# EAGLE design CO2SensorRev01(CDM7160) (EAGLE 9.1.0)
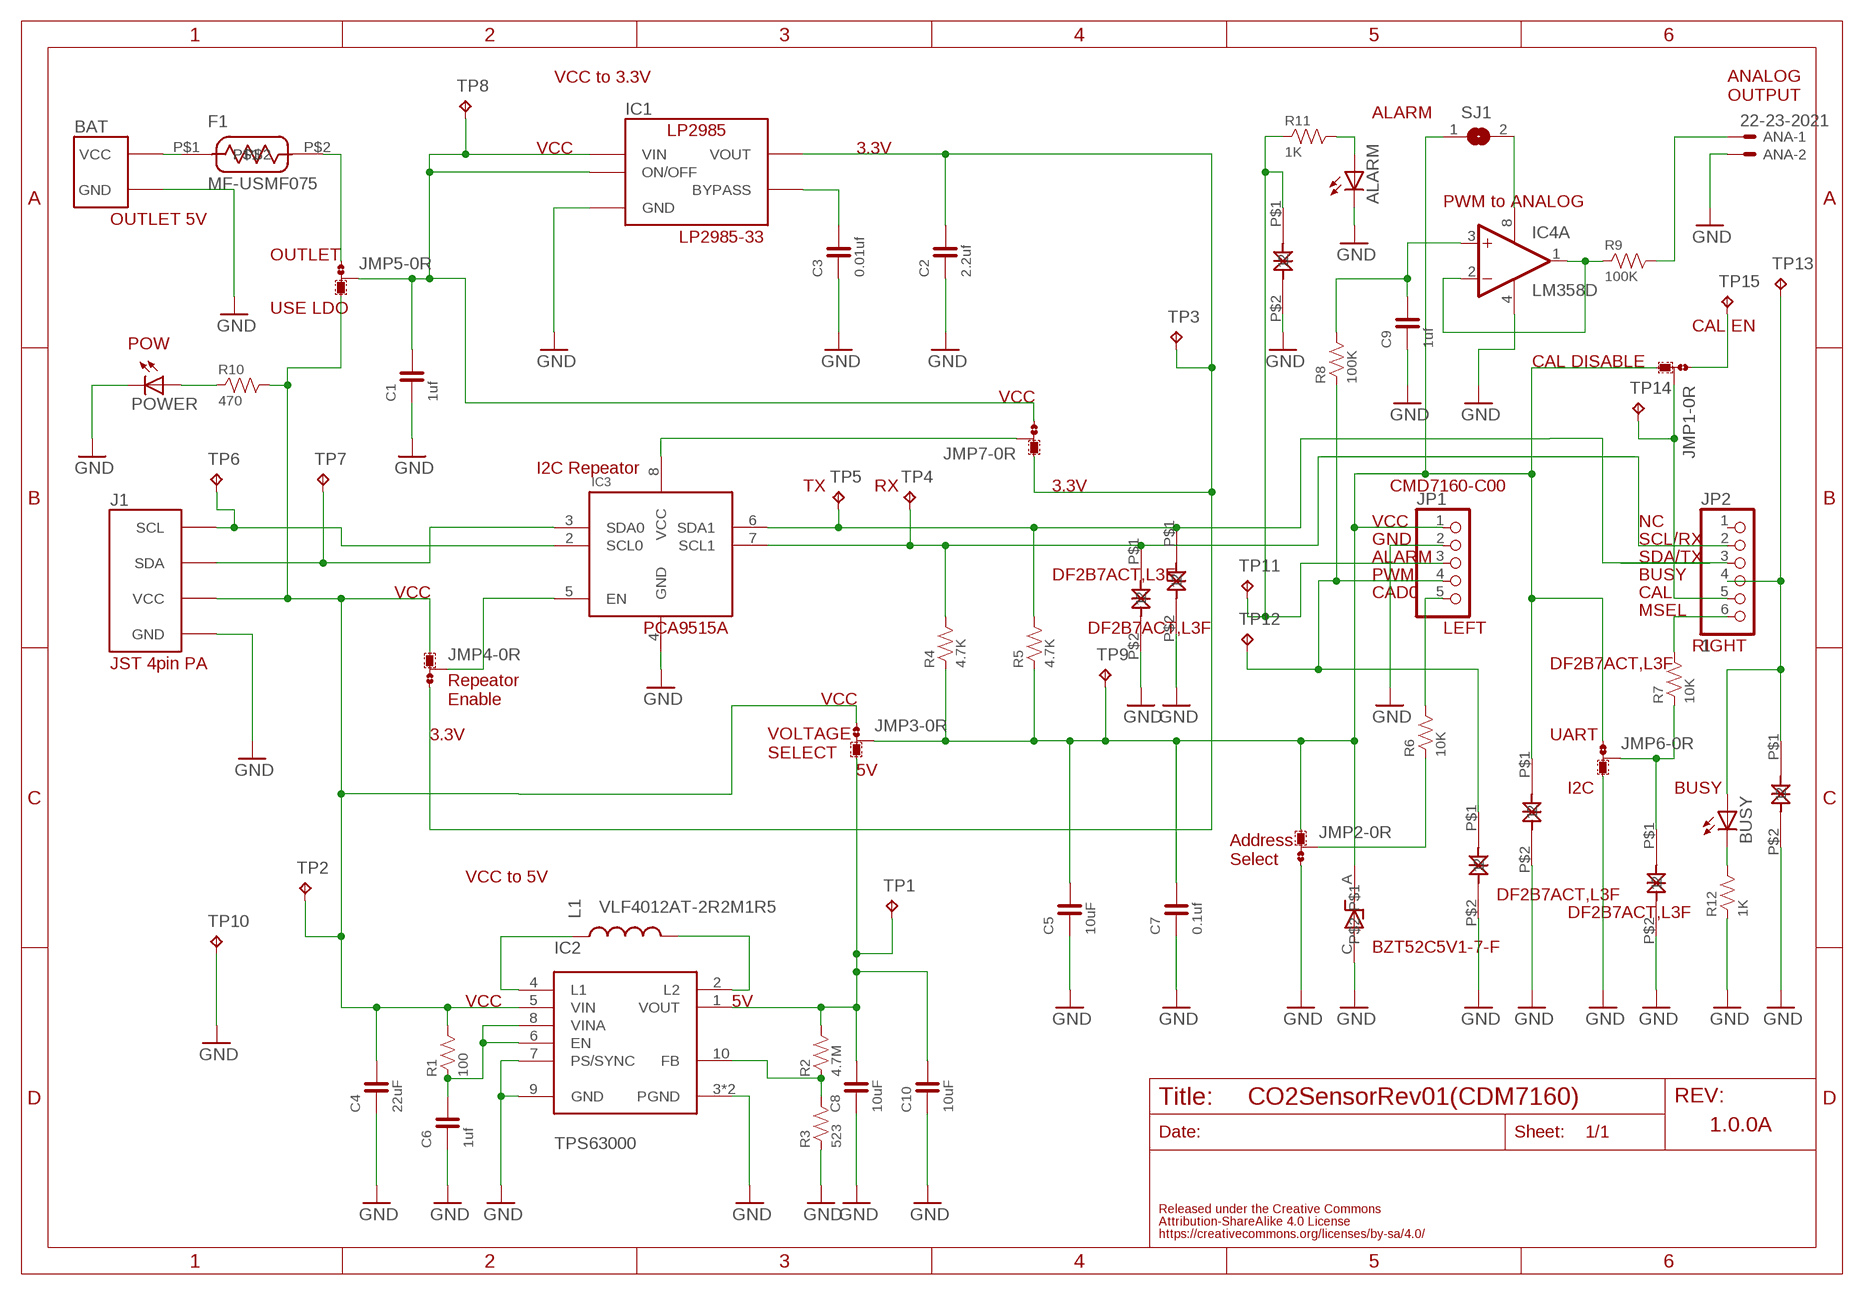
[diagram p0: schematic, sheet 1]

## Parts
ALARM  LEDCHIPLED_0603  [CHIPLED_0603]
ANA  22-23-2021  [22-23-2021]
BAT  FABO_BRICK_2PIN_SIDE  [FABO_BRICK_2PIN_S02B−PASK-2_SILK]
BUSY  LEDCHIPLED_0603  [CHIPLED_0603]
C1  1uf  CAPACITOR-0603  [0603]
C2  2.2uf  CAPACITOR-0603  [0603]
C3  0.01uf  CAPACITOR-0603  [0603]
C4  22uF  CAPACITOR-0805  [0805]
C5  10uF  CAPACITOR-0805  [0805]
C6  1uf  CAPACITOR-0603  [0603]
C7  0.1uf  CAPACITOR-0603  [0603]
C8  10uF  CAPACITOR-0805  [0805]
C9  1uf  CAPACITOR-0603  [0603]
C10  10uF  CAPACITOR-0805  [0805]
D1  BZT52C5V1-7-F  [SOD123]
D3  DF2B7ACT  [DF2B7ACT]
F1  MF-USMF075  [MF-USMF075]
IC1  LP2985-33DBV  [SOT-23-5]
IC2  TPS63000  [DRC-S-PVSON-N10]
IC3  PCA9515  [SO8]
IC4  LM358D  [SO08]
J1  FABO_BRICK_I2C-S04B-PASK-2  [FABO_BRICK_I2C_S04B-PASK-2]
JMP1  0R-JUMPA  [A0R-JMP]
JMP2  0R-JUMPA  [A0R-JMP]
JMP3  0R-JUMPA  [A0R-JMP]
JMP4  0R-JUMPA  [A0R-JMP]
JMP5  0R-JUMPA  [A0R-JMP]
JMP6  0R-JUMPA  [A0R-JMP]
JMP7  0R-JUMPA  [A0R-JMP]
JP1  PINHD-1X5  [1X05]
JP2  1  PINHD-1X6  [1X06]
L1  VLF4012AT-2R2M1R5  [VLF4012A]
POWER  LEDCHIPLED_0603  [CHIPLED_0603]
R1  100  RESISTOR-0603  [0603]
R2  4.7M  RESISTOR-0603  [0603]
R3  523  RESISTOR-0603  [0603]
R4  4.7K  RESISTOR-0603  [0603]
R5  4.7K  RESISTOR-0603  [0603]
R6  10K  RESISTOR-0603  [0603]
R7  10K  RESISTOR-0603  [0603]
R8  100K  RESISTOR-0603  [0603]
R9  100K  RESISTOR-0603  [0603]
R10  470  RESISTOR-0603  [0603]
R11  1K  RESISTOR-0603  [0603]
R12  1K  RESISTOR-0603  [0603]
SJ1  SJW  [SJW]
TP1  TPTP11R  [TP11R]
TP2  TPTP11R  [TP11R]
TP3  TPTP11R  [TP11R]
TP4  TPTP11R  [TP11R]
TP5  TPTP11R  [TP11R]
TP6  TPTP11R  [TP11R]
TP7  TPTP11R  [TP11R]
TP8  TPTP11R  [TP11R]
TP9  TPTP11R  [TP11R]
TP10  TPTP11R  [TP11R]
TP11  TPTP11R  [TP11R]
TP12  TPTP11R  [TP11R]
TP13  TPTP11R  [TP11R]
TP14  TPTP11R  [TP11R]
TP15  TPTP11R  [TP11R]
U$1  DF2B7ACT  [DF2B7ACT]
U$3  DF2B7ACT  [DF2B7ACT]
U$7  DF2B7ACT  [DF2B7ACT]
U$8  DF2B7ACT  [DF2B7ACT]
U$9  DF2B7ACT  [DF2B7ACT]
U$11  DF2B7ACT  [DF2B7ACT]

## Nets
GND: ALARM.C ANA.2 BAT.GND C1.1 C2.1 C3.1 C4.1 C5.1 C6.1 C7.1 C8.1 C9.1 C10.1 D1.C D3.P$2 IC1.2(GND) IC2.3(PGND) IC2.7(PS/SYNC) IC2.9(GND) IC2.TH(PGND) IC3.4(GND) IC4.4(P:V-) J1.GND JMP2.3 JMP6.3 JP1.2 POWER.C R3.1 R12.1 TP10.TP U$1.P$2 U$3.P$2 U$7.P$2 U$8.P$2 U$9.P$2 U$11.P$2
N$1: IC3.2(SCL0) J1.SCL TP6.TP
N$2: IC3.3(SDA0) J1.SDA TP7.TP
N$3: D3.P$1 IC3.7(SCL1) JP2.2 R4.2 TP4.TP
N$4: IC3.6(SDA1) JP2.3 R5.2 TP5.TP U$3.P$1
N$5: C1.2 IC1.1(VIN) IC1.3(ON/OFF) JMP5.2 JMP7.3 TP8.TP
N$6: F1.P$2 JMP5.1
N$7: JMP2.2 R6.1
N$8: IC3.5(EN) JMP4.2
N$9: C2.2 IC1.5(VOUT) JMP4.3 JMP7.1 TP3.TP
N$10: C3.2 IC1.4(BYPASS)
N$11: C6.2 IC2.6(EN) IC2.8(VINA) R1.1
N$12: BAT.VCC F1.P$1
N$13: IC2.10(FB) R2.1 R3.2
N$14: C4.2 IC2.5(VIN) J1.VCC JMP3.1 JMP4.1 JMP5.3 R1.2 R10.2 TP2.TP
N$15: IC2.4(L1) L1.P$1
N$16: IC2.2(L2) L1.P$2
N$17: C8.2 C10.2 IC2.1(VOUT) JMP3.3 R2.2 TP1.TP
N$18: JMP6.2 R7.1 U$7.P$1
N$19: JP2.6 R7.2
N$20: JP1.5 R6.2
N$21: BUSY.A JP2.4 TP13.TP U$8.P$1
N$22: JMP1.2 JP2.5 TP14.TP
N$23: JP1.4 R8.1 TP12.TP U$11.P$1
N$24: JP1.3 R11.1 TP11.TP U$1.P$1
N$25: C9.2 IC4.3(A:+IN) R8.2
N$26: JMP1.1 TP15.TP
N$27: POWER.A R10.1
N$28: ANA.1 R9.2
N$29: IC4.1(A:OUT) IC4.2(A:-IN) R9.1
N$30: ALARM.A R11.2
N$31: BUSY.C R12.2
N$32: IC3.8(VCC) JMP7.2
N$33: C5.2 C7.2 D1.A JMP1.3 JMP2.1 JMP3.2 JMP6.1 JP1.1 R4.1 R5.1 SJ1.1 TP9.TP U$9.P$1
N$34: IC4.8(P:V+) SJ1.2
Unconnected: IC4.5(B:+IN) IC4.6(B:-IN) IC4.7(B:OUT) JP2.1

## Notes on the sheet
- VCC to 3.3V
- ANALOG
  OUTPUT
- ALARM
- VCC | 3.3V
- PWM to ANALOG
- OUTLET 5V
- LP2985-33
- OUTLET
- USE LDO
- CAL EN
- POW
- CAL DISABLE
- VCC
- I2C Repeator
- TX | RX | 3.3V | CMD7160-C00
- VCC | NC
- GND | SCL/RX
- ALARM | SDA/TX
- DF2B7ACT,L3F | PWM | BUSY
- VCC | CAD0 | CAL
- MSEL
- PCA9515A | DF2B7ACT,L3F | LEFT
- RIGHT
- JST 4pin PA | DF2B7ACT,L3F
- Repeator
  Enable
- VCC
- 3.3V | UART
- VOLTAGE
  SELECT
- 5V
- I2C | BUSY
- Address
  Select
- VCC to 5V
- DF2B7ACT,L3F
- DF2B7ACT,L3F
- BZT52C5V1-7-F
- VCC | 5V
- 1.0.0A

## Library data of the parts
ALARM BUSY POWER = led:LED: LED OSRAM: - CHIPLED LG R971, LG N971, LY N971, LG Q971, LY Q971, LO R971, LY R971 LH N974, LH R974 LS Q976, LO Q976, LY Q976 LO Q996 - Hyper CHIPLED LW Q18S LB Q993, LB Q99A, LB R99A - SideLED LS A670, LO A670, LY A670, LG A670, LP A670 LB A673, LV A673, LT A673, LW A673 LH A674 LY A675 LS A676, LA A676, LO A676, LY A676, LW A676 LS A679, LY A679, LG A679 - Hyper Micro SIDELED® LS Y876, LA Y876, LO Y876, LY Y876 LT Y87S - SmartLED LW L88C, LW L88S LB L89C, LB L89S, LG L890 LS L89K, LO L89K, LY L89K LS L896, LA L896, LO L896, LY L896 - TOPLED LS T670, LO T670, LY T670, LG T670, LP T670 LSG T670, LSP T670, LSY T670, LOP T670, LYG T670 LG T671, LOG T671, LSG T671 LB T673, LV T673, LT T673, LW T673 LH T674 LS T676, LA T676, LO T676, LY T676, LB T676, LH T676, LSB T676, LW T676 LB T67C, LV T67C, LT T67C, LS T67K, LO T67K, LY T67K, LW E67C LS E67B, LA E67B, LO E67B, LY E67B, LB E67C, LV E67C, LT E67C LW T67C LS T679, LY T679, LG T679 LS T770, LO T770, LY T770, LG T770, LP T770 LB T773, LV T773, LT T773, LW T773 LH T774 LS E675, LA E675, LY E675, LS T675 LS T776, LA T776, LO T776, LY T776, LB T776 LHGB T686 LT T68C, LB T68C - Hyper Mini TOPLED® LB M676 - Mini TOPLED Santana® LG M470 LS M47K, LO M47K, LY M47K Source: http://www.osram.convergy.de LUXEON: - LUMILED® LXK2-PW12-R00, LXK2-PW12-S00, LXK2-PW14-U00, LXK2-PW14-V00 LXK2-PM12-R00, LXK2-PM12-S00, LXK2-PM14-U00 LXK2-PE12-Q00, LXK2-PE12-R00, LXK2-PE12-S00, LXK2-PE14-T00, LXK2-PE14-U00 LXK2-PB12-K00, LXK2-PB12-L00, LXK2-PB12-M00, LXK2-PB14-N00, LXK2-PB14-P00, LXK2-PB14-Q00 LXK2-PR12-L00, LXK2-PR12-M00, LXK2-PR14-Q00, LXK2-PR14-R00 LXK2-PD12-Q00, LXK2-PD12-R00, LXK2-PD12-S00 LXK2-PH12-R00, LXK2-PH12-S00 LXK2-PL12-P00, LXK2-PL12-Q00, LXK2-PL12-R00 Source: www.luxeon.com KINGBRIGHT: KA-3528ASYC Source: www.kingbright.com
ANA = con-molex:22-23-2021: .100" (2.54mm) Center Header - 2 Pin; MF: MOLEX; MPN: 22-23-2021; OC_FARNELL: 1462926; OC_NEWARK: 25C3832
BAT = FaBo-Template:FABO_BRICK_2PIN
C1-C10 = FaBo-Capacitor:CAPACITOR: CAPACITOR
D1 = FaBo:BZT52C5V1-7-F
D3 U$1 U$3 U$7-U$9 U$11 = FaBo:DF2B7ACT
F1 = FaBo_PTC_ResettableFuses:MF-USMF075
IC1 = FaBo-Supply:LP2985: LP2985
IC2 = FaBo:TPS63000
IC3 = FaBo-Repeater:PCA9515
IC4 = linear:LM358: OP AMP also LM158; LM258; LM2904 Source: http://cache.national.com/ds/LM/LM158.pdf
J1 = FaBo-Template 2:FABO_BRICK_I2C: FaBo Brick I2C
JMP1-JMP7 = jump-0r-smd:0R-JUMP: SMD 0R 0805 Jumper
JP1 = pinhead:PINHD-1X5: PIN HEADER
JP2 = pinhead:PINHD-1X6: PIN HEADER; SPICEPREFIX: X
L1 = FaBo:VLF4012AT-2R2M1R5
R1-R12 = FaBo-Resistors:RESISTOR: RESISTOR
SJ1 = jumper:SJ: SMD solder JUMPER
TP1-TP15 = testpad:TP: Test pad

## Board
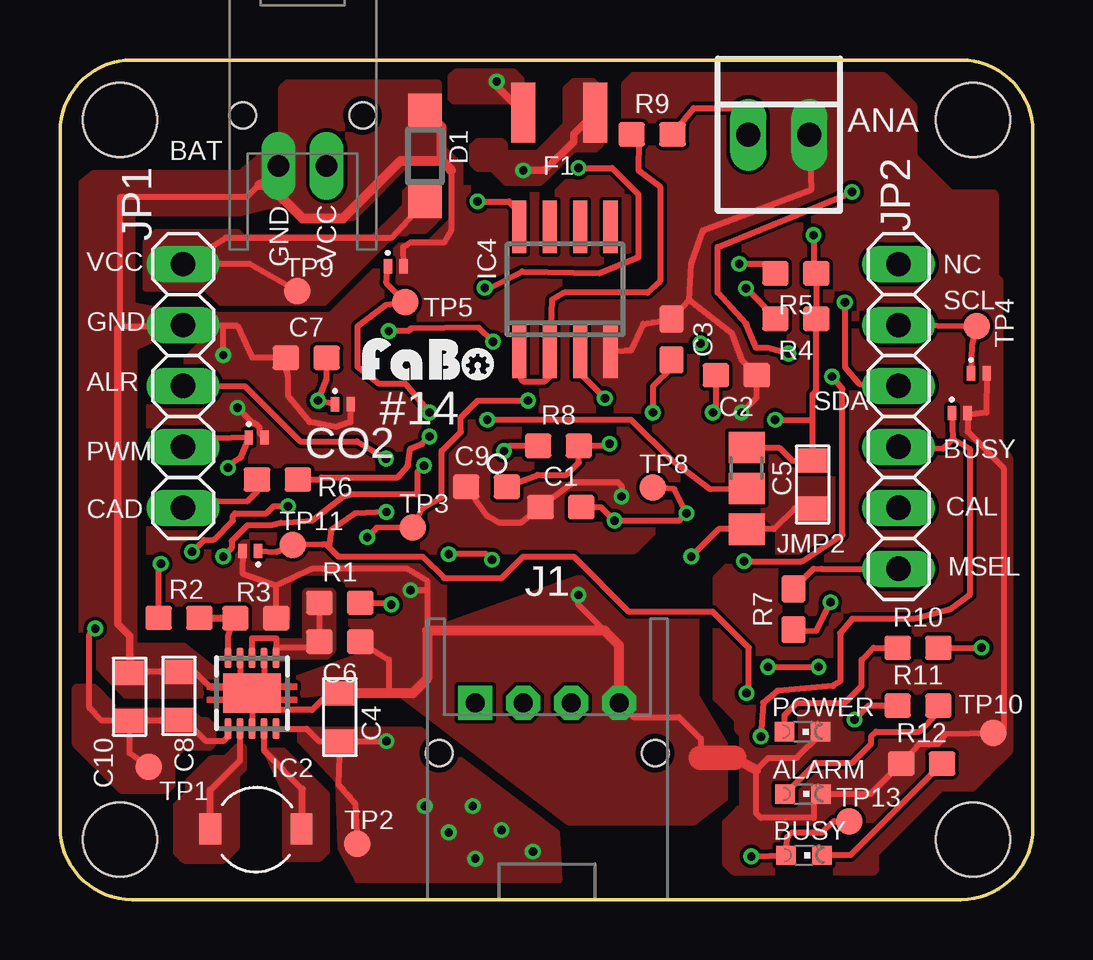
[diagram p1: board, top side]
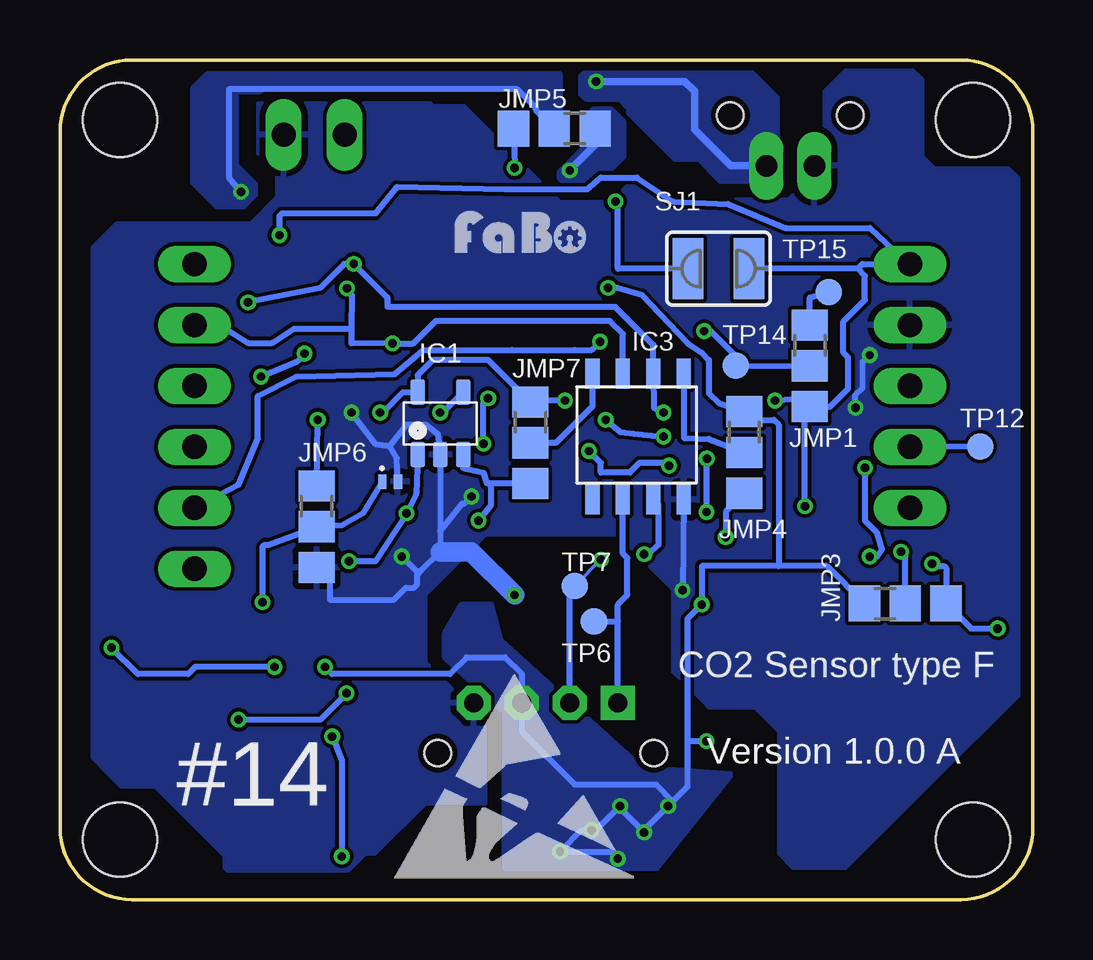
[diagram p2: board, bottom side, seen from below]

Size 40.54 x 35 mm. Coordinates in mm from the lower left corner, seen from the top.
Copper layers (1*16): Top 0.035mm / dielectric 1.5mm / Bottom 0.035mm
Design rules "SeeedStudio_2layer_DRU_no_angle_20140221": minimum track width 6mil, minimum drill 12mil, track to track 6mil, track to pad 6mil, pad to pad 6mil, via to via 6mil, smd to smd 0mil, copper to edge 10mil, drill to drill 10mil, minimum pad ring 10mil, minimum via ring 6mil, stop-mask expansion 2mil, vias tented up to drill 100mil, thermal gap 10mil

### Footprints (pad centres in the part's own frame; a part is rotated, then mirrored left to right if it is on the bottom)
CHIPLED_0603 = smd 0.8 x 0.8: A 0,-0.75; C 0,0.75
22-23-2021 = drill 1 long: 1 -1.27,0; 2 1.27,0
FABO_BRICK_2PIN_S02B−PASK-2_SILK = drill 0.9 pad 1.422 long: GND -1,-0.102; VCC 1,-0.102 | hole 1.1: 2.5,1.998; -2.5,1.998
0603 = smd 1.1 x 1: 1 -0.85,0; 2 0.85,0
0805 = smd 1 x 1.2: 1 -1.254,0; 2 0.746,0
SOD123 = smd 1.4 x 1.4: A 1.9,0; C -1.9,0
DF2B7ACT = smd 0.35 x 0.6: P$1 -0.325,0; P$2 0.325,0
MF-USMF075 = smd 1 x 2.5: P$1 -1.5,0; P$2 1.5,0
SOT-23-5 = smd 0.6 x 1.05: 1 -0.95,-1.3; 2 0,-1.3; 3 0.95,-1.3; 4 0.95,1.3; 5 -0.95,1.3
DRC-S-PVSON-N10 = smd 0.28 x 0.85: 1 -1,-1.475; 2 -0.5,-1.475; 3 0,-1.475; 4 0.5,-1.475; 5 1,-1.475; 6 1,1.475; 7 0.5,1.475; 8 0,1.475; 9 -0.5,1.475; 10 -1,1.475 | smd 2.4 x 1.65: TH 0,0
SO8 = smd 0.6 x 1.25: 1 -1.85,-2.7; 2 -0.58,-2.7; 3 0.69,-2.7; 4 1.96,-2.7; 5 1.96,2.55; 6 0.69,2.55; 7 -0.58,2.55; 8 -1.85,2.55
SO08 = smd 0.6 x 2.2: 1 -1.905,-2.6; 2 -0.635,-2.6; 3 0.635,-2.6; 4 1.905,-2.6; 5 1.905,2.6; 6 0.635,2.6; 7 -0.635,2.6; 8 -1.905,2.6
FABO_BRICK_I2C_S04B-PASK-2 = drill 0.8 pad 1.422 octagon: GND -3,0; SDA 1,0; VCC -1,0 | drill 0.8 pad 1.422 square: SCL 3,0 | hole 1.1: 4.5,2.1; -4.5,2.1
A0R-JMP = smd 1.5 x 1.3: 1 0,1.7; 2 0,0; 3 0,-1.7
1X05 = drill 1.016 long: 1 -5.08,0; 2 -2.54,0; 3 0,0; 4 2.54,0; 5 5.08,0
1X06 = drill 1.016 long: 1 -6.35,0; 2 -3.81,0; 3 -1.27,0; 4 1.27,0; 5 3.81,0; 6 6.35,0
VLF4012A = smd 0.9 x 1.3: P$1 1.9,0; P$2 -1.9,0
SJW = smd 1.27 x 2.54: 1 -1.27,0; 2 1.27,0
TP11R = smd 1.1 x 1.1: TP 0,0
FABO-SHINOBI = hole 3.1: 2.5,32.5; 38.04,32.5; 38.04,2.5; 2.5,2.5

### Placement (x,y rotation side)
ALARM  30.96,4.4 270 top
ANA  29.95,31.88 0 top
BAT  10.11,30.69 0 top
BUSY  31,1.85 270 top
C1  20.87,16.36 0 top
C2  28.18,21.86 180 top
C3  25.48,23.35 270 top
C4  11.66,7.35 270 top
C5  31.36,17.56 90 top
C6  11.66,10.75 180 top
C7  10.26,22.58 0 top
C8  4.96,8.24 270 top
C9  17.77,17.21 0 top
C10  2.9,8.2 270 top
D1  15.2,31 270 top
D3  38.29,21.94 0 top
F1  20.8,32.8 0 top
IC1  24.69,19.85 0 bottom
IC2  8,8.6 0 top
IC3  16.51,19.37 0 bottom
IC4  21.04,25.44 0 top
J1  20.3,8.2 180 top
JMP1  9.3,22.25 0 bottom
JMP2  28.61,17.14 0 top
JMP3  5.32,12.34 90 bottom
JMP4  12.03,18.64 0 bottom
JMP5  19.94,32.14 270 bottom
JMP6  29.85,15.54 0 bottom
JMP7  20.94,19.04 0 bottom
JP1  5.13,21.41 270 top
JP2  34.94,20.14 270 top
L1  8.16,2.95 0 top
POWER  30.94,7 270 top
R1  11.66,12.37 0 top
R2  4.96,11.74 180 top
R3  8.16,11.73 180 top
R4  30.66,24.21 180 top
R5  30.66,26.1 180 top
R6  9.06,17.51 180 top
R7  30.56,12.1 90 top
R8  20.77,18.92 0 top
R9  24.67,31.9 0 top
R10  35.75,10.49 0 top
R11  35.75,8.08 0 top
R12  35.9,5.67 0 top
SJ1  13.1,26.3 180 bottom
TP1  3.69,5.54 0 top
TP2  12.39,2.33 0 top
TP3  14.69,15.52 0 top
TP4  38.19,23.91 0 top
TP5  14.39,24.9 0 top
TP6  18.29,11.59 0 bottom
TP7  19.09,13.08 0 bottom
TP8  24.69,17.17 0 top
TP9  9.89,25.36 0 top
TP10  38.89,6.95 0 top
TP11  9.69,14.79 0 top
TP12  2.19,18.88 0 bottom
TP13  32.89,3.27 0 top
TP14  12.39,22.26 0 bottom
TP15  8.5,25.33 0 bottom
U$1  7.93,14.53 180 top
U$2  [FABO-SHINOBI]  0,0 0 top
U$3  13.99,26.4 0 top
U$5  [ESD_10.00]  26.7,0.8 0 bottom
U$6  [LOGO_FABO_S]  15.4,21.5 0 top
U$7  26.79,17.42 0 bottom
U$8  37.49,20.28 0 top
U$9  11.79,20.64 0 top
U$10  [LOGO_FABO_S]  21.3,26.8 0 bottom
U$11  8.19,19.26 0 top

### Tracks (layer width: path | path; a pad name or v marks a point on that pad's centre or on a via)
GND  (via drill 0.35)
  Top 0.254: IC2.TH IC2.3 | IC2.9 7.5,9.4 7.6,9.3 7.6,9 7.75,8.85 | IC2.7 8.5,9.1 8.15,8.75 | 8.15,8.75 IC2.TH | 7.75,8.85 IC2.TH | C4.1 11.2,8.6 10.5,7.9 9,7.9 8.15,8.75 | 7.75,8.85 6.25,8.85 5.61,9.49 C8.1 2.94,9.49 C10.1 | C5.1 30.61,16.31 29.74,15.44 JMP2.3 27.44,15.44 v26.3,14.3 | POWER.C 31.69,6.89 30.7,5.9 29.5,5.9 29,5.4 29,3.6 29.2,3.4 31.4,3.4 31.41,3.41 31.41,4.1 ALARM.C 33.78,4.4 R12.1 35.8,6.5 36.6,6.5 36.9,6.9 TP10.TP 39.32,7.1 39.32,18 37.81,19.5 37.81,20.2 | C6.1 13.7,10 13.7,8.6 | IC4.4 23.8,22.9 24.3,24 C3.1 26.22,24.98 | ANA.2 31.3,29.6 26.8,27.9 26.3,26.5 26.22,24.98 | 26.22,24.98 28,23.6 28.43,22.46 C2.1 29,20.9 v28.4,20.3 | R3.1 9,13.1 | 9,13.1 10.54,13.8 14.47,13.8 15.3,13.3 15.3,12.9 | 15.3,12.9 15.3,11.2 | v14.6,12.9 15.3,12.9 | U$1.P$2 7.6,13.6 9,13.1 | C7.1 9.3,22.58 | 9.3,22.58 8,22.6 7.4,23.9 6.8,23.91 | 6.8,23.91 JP1.2 5.08,23.9 2.5,23.9 2.5,29.3 7.8,29.3 8.3,29.8 BAT.GND | U$3.P$2 14.3,27.2 14.6,27.4 16,27.4 16.3,27.9 16.3,30.4 | U$9.P$2 12.1,19.9 11.5,19.7 10.4,19.9 9.5,21 9.5,21.8 9.3,22.58 | U$11.P$2 8.32,19.46 8.32,19.68 8.16,19.84 8.06,19.84 v7.4,20.5 | v6.8,22.7 6.8,23.91 | U$8.P$2 37.81,20.2 | C9.1 17.8,16 18.3,15.7 19.2,15.7 C1.1 21.26,17.29 21.27,17.29 21.28,17.3 21.4,17.4 23.24,17.4 23.4,17.24 v23.4,16.8 | D3.P$2 38.6,20.3 37.81,20.2 | 13.7,8.6 | J1.GND 23.9,7.6 25.8,7.6 26.7,6.7 26.7,5.9 | 23.3,10.6 21.6,12.3 v21.6,12.7
  Top 0.305: C10.1 2.9,11 2.4,11.5 2.4,23.8 2.5,23.9
  Top 0.406: 28.1,5.9 29,5.4 | 8.3,29.8 8.71,29.8 10.1,28.4 11.8,28.4 14.2,30.8 15.9,30.8 | 15.9,30.8 16.3,30.4 | 15.9,30.8 15.9,32.2 D1.C | J1.GND 23.3,10.6 22.7,11.2 15.3,11.2 15.3,9.2 14.7,8.6 13.7,8.6 C4.1
  Top 1.016: 26.7,5.9 28.1,5.9
  Bottom 0.254: 24.7,15.36 IC1.2 24.8,19.4 25.3,19.8 26.1,19.8 26.8,18.9 | 25.5,13.7 25.66,13.54 25.66,13.14 25.8,13 26.13,13 26.63,12.5 29.3,12.5 29.3,13.29 JMP6.3 | 25.5,13.7 24.7,14.5 24.7,15.36 | IC3.4 v14.6,12.9 | v28.4,20.3 27.4,19 26.8,18.9 | U$7.P$2 26.5,18.4 26.8,18.9 | v7.4,20.5 7.4,21.02 7.09,21.33 7.09,22.41 v6.8,22.7 | 24.7,15.36 23.8,16.5 23.7,16.5 v23.4,16.8 | v26.3,14.3 25.7,13.7 25.5,13.7
  Bottom 0.813: v21.6,12.7 23.4,14.5 24.7,14.5
  pour Top (no thermals): 6.79,8.14 21.55,13.4 26.5,13.4 26.5,8.5 27.7,6.5 27.7,4.2 26.4,3.2 21.21,3.2 13.71,8.91
  pour Top (no thermals): 6.9,9.2 6.9,8.5 2.71,8.5 0.9,10.36 0.9,29.9 1.4,30.3 7.5,30.3 8.6,31.2 9.6,30.4 9.1,29 7.5,28.6 3,28.6 3,24.8 4.7,24.5 4.7,23.7 3.1,23 3.1,10.6 5.15,10.6
  pour Top (no thermals): 6.1,24.3 11.3,24.3 14.2,27.2 15.3,27.2 16.4,28.3 16.4,30.3 15.8,30.9 14.6,30.9 12.2,28.5 10.2,28.5 9.7,29 9.7,29.3 10,29.6 10,31.1 9.3,31.8 9.3,33.8 9.5,34 15.7,34 15.7,31.5 16.6,30.6 16.6,29.6 17.3,29.6 17.4,29.5 18.1,29.5 18.3,29.3 20.6,29.3 21.8,30.5 22.3,30.5 23.6,31.8 23.6,34 23.9,34.3 24.1,34.3 34.3,34.3 35.5,33.1 35.5,31 37,29.5 37.1,29.4 38.9,29.4 38.9,26 39.1,25.8 39.1,18.8 39.5,18.4 39.5,6.2 38.6,5.3 38,4.7 36.7,4.7 33.9,1.9 33.9,1.2 28.1,1.2 27.8,1.5 27.8,3.2 27.9,3.3 28.3,3.7 28.5,3.7 28.5,6.9 28.3,7.1 28.3,7.5 27.4,8.4 27.4,13.4 28.4,14.4 29.8,14.4 30,14.6 30,15.5 29.2,16.3 25.6,16.3 23.9,14.6 16.2,14.6 16,14.4 15.9,14.3 15.9,11.5 15.8,11.4 13.3,10.7 13,10.7 12.1,11.6 12.1,13.2 11.6,13.7 9.9,13.7 9.4,13.2 9.4,11.7 9.1,11.4 4.3,11.4 3.8,11.9 3.8,21 6,23.2 6,24.2 14,11.4
  pour Bottom: 0.6,30.1 1,30.5 4.1,30.5 4.2,30.6 4.6,31 4.6,34.2 5,34.6 5.8,34.6 7.8,34.6 8.2,34.2 8.6,33.8 8.7,33.7 8.7,31.2 8.7,30.7 10.2,29.2 13.7,29.2 13.8,29.3 14.91,30.41 16.29,30.41 17.6,29.1 18,29.1 19.7,29.1 20.8,30.2 23.7,33.1 25,33.1 25.1,33.2 32.3,33.2 32.3,31.1 31.5,30.3 31.5,29.3 32.6,28.2 32.8,28.2 38.2,28.2 39.2,27.2 39.2,5.9 38.5,5.2 38,4.7 36.6,4.7 33.7,1.8 33.7,1.3 33.6,1.2 28.5,1.2 27.8,1.9 27.4,1.9 25.3,4 22.8,4 22.8,7.4 25.3,9.9 25.3,12.7 23.6,14.4 22.8,15.2 21.1,15.2 17.3,15.2 15,12.9 15,9.5 13.7,8.2 13.5,8 11.6,8 10.6,7 10.6,1.9 10,1.3 9,1.3 7.8,1.3 4.2,4.9 0.6,8.5
N$1
  Bottom 0.254: IC3.2 17.09,14.42 16.9,14.23 16.9,12.7 17.3,12.3 17.3,11.6 | J1.SCL 17.3,11.6 | TP6.TP 17.31,11.59 17.3,11.6
N$2  (via drill 0.35)
  Top 0.254: v18,14.17 17.77,14.4 v16.2,14.4
  Bottom 0.152: TP7.TP v18,14.17
  Bottom 0.254: J1.SDA 19.3,12.87 TP7.TP | v16.2,14.4 16,14.4 15.6,14.8 15.6,16.45 IC3.3
N$3  (via drill 0.35)
  Top 0.254: JP2.2 TP4.TP 38,23.1 D3.P$1 | v28.59,25.48 29.81,24.26 R4.2
  Bottom 0.254: JP2.2 33.8,23.9 32.7,23.2 31.7,23.2 30.8,23.8 28.4,23.8 | 28.4,23.8 28.38,25.18 28.59,25.39 v28.59,25.48 | 28.4,23.8 28.4,23.19 v26.68,23.18 25.82,23.18 24.88,24.12 17.62,24.12 17.09,23.59 IC3.7
N$4  (via drill 0.35)
  Top 0.254: v28.3,26.5 29.41,26.5 R5.2 | v32.7,24.9 32.7,23.2 32.7,22.2 33.3,21.5 JP2.3 | U$3.P$1 13.6,25.7 TP5.TP 13.6,24.8 12.4,23.9 12.4,22.2 13.3,21.5 14.4,21.5 v15.4,20.3
  Bottom 0.254: 15.82,23.12 IC3.6 15.8,20.5 v15.4,20.3 | 15.82,23.12 16.9,24.2 17.4,24.7 26.9,24.7 26.9,25.1 v28.3,26.5 28.7,26.5 29.7,25.5 v32.7,24.9 | 15.82,23.12
N$5  (via drill 0.35)
  Top 0.254: C1.2 22.54,16.36 v23.1,15.8 25.8,15.8 v26.1,16.1 25.6,17.11 24.79,17.17 TP8.TP | v33,29.5 27.4,27.2 27.4,25.3 28.6,24 29,23 29.5,23 v30.35,22.76 | v28.5,14.1 30.9,14.1 32.6,15.2 32.6,21.3 v32.17,21.8
  Bottom 0.254: IC1.3 23.74,18 22.9,17.8 22.77,17.41 | IC1.1 25.7,16.9 v26.1,16.1 27.4,14.1 v28.5,14.1 | JMP5.2 20.71,32.91 20.71,33.01 21.49,33.78 33.5,33.78 33.5,30.1 v33,29.5 | v32.17,21.8 30.63,22.46 v30.35,22.76 | 22.77,17.41 22.75,17.35 22.65,17.35 | 22.65,17.35 22.6,17.2 22.6,16.43 v23.1,15.8 | 22.77,17.41 | JMP7.3 22.65,17.35
  pour Bottom (no thermals): 19.7,34.4 34.4,34.4 35,33.8 35,29.9 34.1,29 34,28.9 32.9,28.9 32.4,29.4 32.4,29.8 33.2,30.6 33.2,30.8 33.2,33.7 32.2,33.7 32.1,33.8 21.5,33.8 20.7,33 20.6,33 20.3,32.7 19.8,32.7 19.7,32.8
N$6  (via drill 0.35)
  Top 0.305: F1.P$2 21.4,31.9 21.4,31.6 20.2,30.4 v19.3,30.4
  Bottom 0.305: v19.3,30.4 18.24,31.46 JMP5.1
  pour Bottom (no thermals): 17.6,32.9 18.3,32.9 18.4,32.8 18.5,32.7 18.5,31.5 19.7,30.3 19.7,30.1 19.3,29.7 19.1,29.7 18.4,29.7 17.1,31 17.1,32.4
  pour Top (no thermals): 17.2,30.7 17.2,31.4 17.3,31.5 17.4,31.6 18.4,31.6 18.5,31.5 18.5,31.1 19.9,31.1 21.1,32.3 21.1,32.8 21.1,33.8 21.4,34.1 22.2,34.1 22.5,33.8 22.5,33.6 22.5,31.5 22.3,31.3 21.4,31.3 20,29.9 18.6,29.9 18,30.5 17.4,30.5
N$7  (via drill 0.35)
  Top 0.254: JMP2.2 27.1,17.1 25.5,18.3 23.8,20 v17.8,20 | v15.4,19.3 15.08,18.98 14.6,18.8 14.5,18.07 14.07,17.6 10.9,17.6 10.81,17.51 R6.1
  Bottom 0.254: v17.8,20 17.2,19.5 15.5,19.3 v15.4,19.3
N$8
  Bottom 0.254: IC3.5 14.55,19.25 13.5,19.2 JMP4.2
N$9  (via drill 0.35)
  Top 0.254: C2.2 27.33,20.43 v27.2,20.3 | v19.5,20.8 17.4,20.8 16.7,20.1 16.7,19.5 15.9,18.7 15.9,16.76 15.1,16.3 TP3.TP 13.19,15.49 v12.8,15.1
  Bottom 0.254: JMP7.1 21,20.8 | 21,20.8 22.7,22.5 25,22.5 25.64,21.86 IC1.5 26.25,21.15 27.1,20.3 v27.2,20.3 | JMP4.3 12.8,16.17 v12.8,15.1 | v19.5,20.8 21,20.8
N$10  (via drill 0.35)
  Top 0.254: C3.2 25.48,22.18 24.7,21.4 v24.7,20.3
  Bottom 0.254: v24.7,20.3 24.59,20.3 IC1.4
N$11
  Top 0.254: IC2.8 8,10.9 9,10.9 9,10.5 | 9,10.5 IC2.6 | 9,10.5 10.56,10.5 C6.2 R1.1
  pour Top (no thermals): 9.1,10.1 9.1,10.6 9.2,10.7 10.3,10.7 10.3,12.8 11.3,12.8 11.3,10.4 11.1,10.2 10.2,10.2 9.5,10.2 9.4,10.1 9.2,10.1
N$12  (via drill 0.35)
  Top 0.305: v18.2,34.1 18.2,33.9 F1.P$1
  Bottom 0.305: BAT.VCC 12.59,30.59 14.1,32.1 14.1,33.7 14.5,34.1 16.8,34.1 17,34.1 v18.2,34.1
  pour Bottom (no thermals): 10.7,30 10.7,33.4 11.7,34.4 18.7,34.4 18.8,34.3 18.8,33.6 18.7,33.5 18.6,33.4 17.2,33.4 16.8,33 16.8,32.8 14.9,30.9 13.9,30.9 13,30
  pour Top (no thermals): 16.5,34.5 18.8,34.5 18.9,34.5 19.2,34.2 19.2,33.3 16.4,33.3 16.3,33.4 16.3,34.3
N$13
  Top 0.254: IC2.10 7,11 7.2,11.62
  Top 0.3: 7.2,11.62 R3.2 R2.1
N$14  (via drill 0.35)
  Top 0.254: C4.2 10.8,6.6 10.28,7.12 9.4,7.12 IC2.5 | C4.2 v13.6,6.6 | R1.2 13.73,12.37 v13.8,12.3 | R10.2 v38.39,10.49 v38.4,10.5 | v21.6,30.5 23,30.5 24.1,29.4 24.1,26.77 22.47,26.11 19.26,26.18 17.9,25.5 v17.7,25.5 | C4.2 11.6,4.8 12.3,4 TP2.TP | v29.5,9.7 v31.6,9.7
  Bottom 0.254: v13.6,6.6 14.4,6.6 | 14.4,6.6 14.4,11.7 v13.8,12.3 13.8,13.9 10.6,13.9 | JMP3.1 8.58,13.9 10.6,13.9 | 10.6,13.9 10.6,19.8 10.8,20 11.69,20 JMP4.1 13.1,20.7 13.5,21.1 13.5,22.5 13.8,22.8 14.4,23.2 16.3,25.2 17.3,25.5 v17.7,25.5 | v38.4,10.5 37.3,9.4 35.2,9.4 34.9,9.7 v31.6,9.7 | JMP5.3 v21.6,30.5 | 14.4,6.6 | 14.4,6.6 14.4,4.7 15,4.1 | 15,4.1 v15.2,3.9 16.2,2.9 v16.2,2.8 17.2,3.8 v17.2,3.9 18.2,2.9 v18.4,2.9 18.8,2.9 v19.7,2 17.6,2 v17.3,1.7 | 15,4.1 15.7,4.8 19.1,4.8 21.3,7 J1.VCC 21.3,9.4 22,10.1 23.6,10.1 24.3,9.4 29.2,9.4 v29.5,9.7
  pour Top (no thermals): 10,7.1 15,7.1 20.7,2.8 20.8,0.8 12.4,0.8 11.7,2.1 11.6,4.9 10,6.6
  pour Bottom (no thermals): 12.6,5.24 12.6,5.2 15.7,1.3 22,1.3 22,7.8 24.5,10.1 24.5,11.1 23.8,12.3 22.58,12.3 22.19,10.81 16.33,5.5
N$15
  Top 0.254: 10.1,4.6 8.5,6.2 IC2.4
  Top 0.3: 10.1,4.6 10.1,2.99 L1.P$1
  pour Top (no thermals): 8.6,6.2 9.3,6.2 9.4,6.1 10.6,4.9 11.1,4.4 11.1,2 10.8,1.7 10.6,1.7 9.5,1.7 9.4,1.8 9.4,4.5
N$16
  Top 0.254: 6.26,4.56 7.5,5.8 IC2.2
  Top 0.3: L1.P$2 6.26,4.56
  pour Top (no thermals): 7.3,2.4 7.3,3.9 7.3,5.2 7.6,5.5 7.6,6.3 7.4,6.3 6.9,5.8 6.3,5.8 5.4,4.9 5.4,4.4 4.9,3.9 4.9,3.4 4.9,2 5,1.9 5.2,1.7 6.8,1.7 7.3,2.2
N$17  (via drill 0.35)
  Top 0.254: IC2.1 7,6.8 6.8,6.6 6.1,6.6 5.21,7.49 C8.2 4.92,7.45 C10.2 | C10.2 1.75,7.45 1.22,7.98 1.22,11.05 v1.47,11.3 | TP1.TP 2.9,6.1 C10.2 | R2.2 4.11,13.91 v4.2,14
  Bottom 0.254: v1.47,11.3 2.58,11.3 JMP3.3 3.62,13.82 3.7,13.9 4.1,13.9 v4.2,14
  pour Top (no thermals): 0.7,8.8 1.4,8.8 2.1,8.1 2.1,7.8 5.4,7.8 5.8,7.4 6.1,7.4 6.3,7.2 6.3,6.5 6.2,6.4 5.1,6.4 4.6,5.9 4.6,4.8 4.4,4.6 3.3,4.6 2.6,4.6 0.7,6.5
N$18  (via drill 0.35)
  Top 0.254: R7.1 31.5,11.2 v32.1,12.4
  Bottom 0.254: v32.1,12.4 32.1,14.7 32,14.8 31.88,14.79 JMP6.2 28.8,15.6 27.92,16.1 U$7.P$1
N$19
  Top 0.254: JP2.6 31.72,13.79 31.4,13.8 31.32,13.71 R7.2
N$20
  Top 0.254: R6.2 8.21,17.01 7.8,16.6 5.43,16.63 JP1.5
N$21  (via drill 0.35)
  Top 0.254: TP13.TP 32.24,3.27 31.77,2.79 30.49,2.79 30.3,2.6 BUSY.A v28.8,1.8 | U$8.P$1 37.2,19.2 | 37.2,19.2 37.9,18.8 37.9,12.7 37.1,12.1 35.6,11.7 33,11.7 32.5,11.1 32.5,9.1 32.2,8.9 29.9,8.7 29.3,8.2 v29.2,6.8 | JP2.4 36.8,18.8 37.2,19.2
  Bottom 0.254: v29.2,6.8 28.8,5.8 v28.8,1.8
N$22  (via drill 0.35)
  Top 0.254: v13.7,23.7 14.53,23.7 14.62,23.8 17.46,23.84 v18.04,23.26
  Bottom 0.254: JP2.5 33.1,17.3 32.3,19.2 32.3,21 30.7,21.8 26.6,21.9 25.4,22.9 25.18,22.9 25.17,22.91 21.7,22.91 19.1,22.91 18.39,22.91 v18.04,23.26 | JMP1.2 TP14.TP 12.39,22.66 13.43,23.7 v13.7,23.7
N$23  (via drill 0.35)
  Top 0.254: JP1.4 5.7,19.2 U$11.P$1 7.5,18.4 7,18.1 v7,18 | v15.16,18.09 14.9,17.83 14.9,16.9 12.2,16.9 11.8,16.8 10.5,15.8 9.2,15.7 8.8,15.6 7.8,15.6 7.15,14.95 7.15,14.65 v6.8,14.3 | v18.5,18.7 18.72,18.92 R8.1
  Bottom 0.254: TP12.TP JP1.4 | v6.8,14.3 6.5,14.3 6.3,14.6 6.5,15.3 7,15.8 v7,18 | v15.16,18.09 15.27,18.2 16.4,18.2 16.8,17.8 18,17.8 18,18.2 v18.5,18.7
N$24  (via drill 0.35)
  Top 0.254: R11.1 33.68,8.08 v33.1,7.5 | U$1.P$1 9,14.5 TP11.TP 10.93,14.8 11.1,14.8 11.2,14.7 | JP1.3 7.7,21.4 10,19.1 12.38,19.1 v13.59,18.38 | 11.2,14.7 11.6,14.3 15.1,14.3 16,13.4 18.4,13.4 19.3,14.3 21.4,14.3 23.7,12 27.2,12 28.7,10.5 28.7,8.7 v28.6,8.6 | v13.6,16.16 12.3,16.1 11.3,15.4 11.2,14.7
  Bottom 0.254: v13.6,16.16 v13.59,18.38 | v28.6,8.6 29.7,7.5 v33.1,7.5
N$25  (via drill 0.35)
  Top 0.254: C9.2 19.9,17.7 21.1,17.7 21.62,18.22 R8.2 22.82,18.92 v22.9,19 | IC4.3 21.68,21.93 v22.7,20.9
  Bottom 0.254: v22.9,19 22.9,20.7 v22.7,20.9
N$26
  Bottom 0.254: JMP1.1 9.3,25.1 TP15.TP
N$27
  Top 0.254: POWER.A 30.19,7.69 30.7,8.2 32.7,8.2 33.4,8.9 33.4,10 33.89,10.49 R10.1
N$28
  Top 0.254: R9.2 26.4,33 28,33 28.7,32.5 ANA.1
N$29
  Top 0.254: R9.1 24.11,31.61 24.1,30.4 25,29.73 25,25.79 24.48,25.3 21,25.3 20.5,25 IC4.2 20.41,22.3 20.4,22.3 20.4,21.8 20.2,21.6 19.3,21.6 19.2,21.7 19.2,22.77 IC4.1
N$30
  Top 0.254: ALARM.A 31.51,5.7 33,5.7 33.8,6.5 33.8,6.8 34,7 35.8,7 36.6,7.8 R11.2
N$31
  Top 0.254: R12.2 32.93,1.85 BUSY.C
N$32
  Bottom 0.254: IC3.8 18.36,20.56 19.88,19.04 JMP7.2
N$33  (via drill 0.35)
  Top 0.254: v31.4,27.7 31.4,26.21 R5.1 R4.1 31.51,21.21 31.36,21.06 31.36,20 | 31.36,20 C5.2 30.5,18.3 29.96,18.84 JMP2.1 | v29.8,20 31.36,20 | D1.A 13.82,27.6 6.92,27.6 JP1.1 7.9,26.5 TP9.TP | U$9.P$1 v10.75,20.8 11.1,21.7 C7.2 | v5.5,14.5 6,15 6.4,15 7.2,15.8 7.2,16 7.3,16.1 8.6,16.1 8.9,16.4 v9.5,16.4
  Bottom 0.254: JMP1.3 8.45,20.55 7.7,21.3 7.7,22.6 7.9,22.8 7.9,24.1 7,25 7,26 7.3,26.3 | 7.3,26.3 7.11,26.49 5.2,26.49 | 5.2,26.49 JP1.1 | v31.4,27.7 31.4,28.5 31.3,28.6 27.4,28.6 26.5,29.7 22,29.6 18.6,29.6 18,30.1 16.5,30.1 15,29.1 12.7,29 10.3,28 6.8,28 5.2,26.49 | 7.3,26.3 SJ1.1 | JMP6.1 v29.8,20 | v10.75,20.8 9.7,20.9 JMP1.3 | v5.5,14.5 5.32,14.32 JMP3.2 | v9.5,16.4 9.5,20.35 JMP1.3
  pour Top (no thermals): 3.6,25.5 3.6,27.4 4,27.8 7.4,27.8 7.6,27.6 13.1,27.6 14,28.5 14.4,28.9 14.4,29.5 14.7,29.8 14.9,29.8 15.4,29.8 15.7,29.5 15.7,28.4 15.5,28.2 15.2,27.9 14.5,27.9 14.4,27.8 13.9,27.8 11,24.9 7.7,24.9 6.7,24.9 6.1,25.5
N$34  (via drill 0.35)
  Top 0.254: v17.4,29.1 18.7,29.1 19.14,28.66 IC4.8
  Bottom 0.254: SJ1.2 17.3,26.3 17.3,29 v17.4,29.1

### Text on the board
tPlace: VCC | NC | SCL | GND | ALR | #14 | SDA | PWM | CO2 | BUSY | CAD | CAL | MSEL
bPlace: CO2 Sensor type F | Version 1.0.0 A | #14